# EAGLE design zerg_mc (EAGLE 7.6.0)
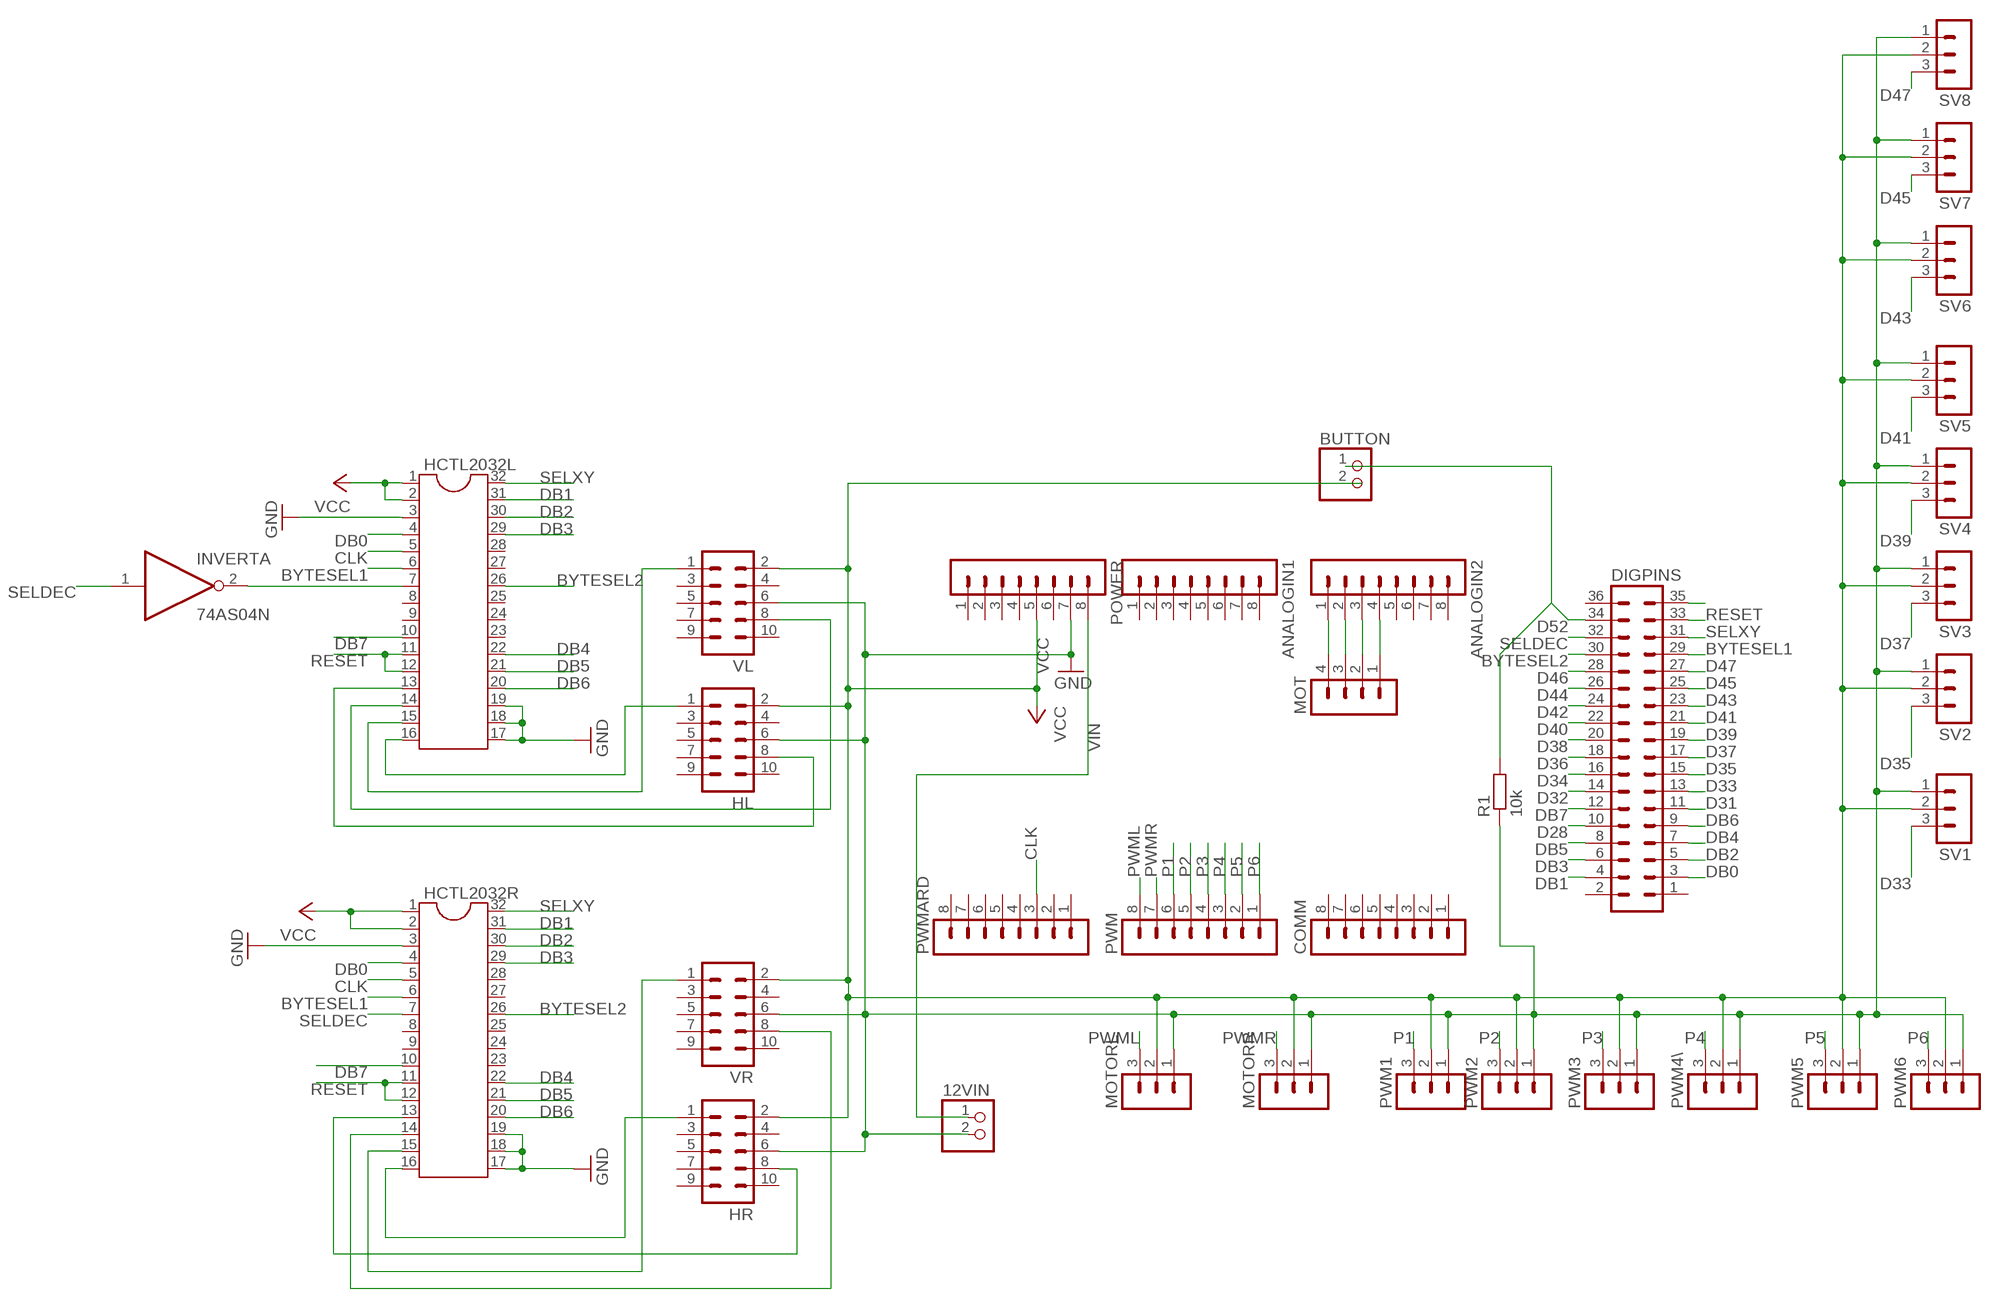
[diagram p0: schematic, sheet 1]

## Parts
12VIN  PINHD-1X2  [1X02]
ANALOGIN1  MA08-1  [MA08-1]
ANALOGIN2  MA08-1  [MA08-1]
BUTTON  PINHD-1X2  [1X02]
COMM  MA08-1  [MA08-1]
DIGPINS  MA18-2  [MA18-2]
HCTL2032L  DIL32  [DIL32]
HCTL2032R  DIL32  [DIL32]
HL  MA05-2  [MA05-2]
HR  MA05-2  [MA05-2]
INVERT  74AS04N  [DIL14]
MOT  MA04-1  [MA04-1]
MOTORL  MA03-1  [MA03-1]
MOTORR  MA03-1  [MA03-1]
POWER  MA08-1  [MA08-1]
PWM  MA08-1  [MA08-1]
PWM1  MA03-1  [MA03-1]
PWM2  MA03-1  [MA03-1]
PWM3  MA03-1  [MA03-1]
PWM4\  MA03-1  [MA03-1]
PWM5  MA03-1  [MA03-1]
PWM6  MA03-1  [MA03-1]
PWMARD  MA08-1  [MA08-1]
R1  10k  R-EU_0207/10  [0207/10]
SV1  MA03-1  [MA03-1]
SV2  MA03-1  [MA03-1]
SV3  MA03-1  [MA03-1]
SV4  MA03-1  [MA03-1]
SV5  MA03-1  [MA03-1]
SV6  MA03-1  [MA03-1]
SV7  MA03-1  [MA03-1]
SV8  MA03-1  [MA03-1]
VL  MA05-2  [MA05-2]
VR  MA05-2  [MA05-2]

## Nets
BYTESEL1: DIGPINS.29 HCTL2032L.6 HCTL2032R.6
BYTESEL2: DIGPINS.30 HCTL2032L.26 HCTL2032R.26
CLK: HCTL2032L.5 HCTL2032R.5 PWMARD.3
D28: DIGPINS.10
D31: DIGPINS.11
D32: DIGPINS.14
D33: DIGPINS.13 SV1.3
D34: DIGPINS.16
D35: DIGPINS.15 SV2.3
D36: DIGPINS.18
D37: DIGPINS.17 SV3.3
D38: DIGPINS.20
D39: DIGPINS.19 SV4.3
D40: DIGPINS.22
D41: DIGPINS.21 SV5.3
D42: DIGPINS.24
D43: DIGPINS.23 SV6.3
D44: DIGPINS.26
D45: DIGPINS.25 SV7.3
D46: DIGPINS.28
D47: DIGPINS.27 SV8.3
D52: BUTTON.1 DIGPINS.34 R1.2
DB0: DIGPINS.3 HCTL2032L.4 HCTL2032R.4
DB1: DIGPINS.4 HCTL2032L.31 HCTL2032R.31
DB2: DIGPINS.5 HCTL2032L.30 HCTL2032R.30
DB3: DIGPINS.6 HCTL2032L.29 HCTL2032R.29
DB4: DIGPINS.7 HCTL2032L.22 HCTL2032R.22
DB5: DIGPINS.8 HCTL2032L.21 HCTL2032R.21
DB6: DIGPINS.9 HCTL2032L.20 HCTL2032R.20
DB7: DIGPINS.12 HCTL2032L.10 HCTL2032R.10
GND: 12VIN.2 HCTL2032L.3 HCTL2032L.17 HCTL2032L.18 HCTL2032L.19 HCTL2032R.3 HCTL2032R.17 HCTL2032R.18 HCTL2032R.19 HL.6 HR.6 MOTORL.1 MOTORR.1 POWER.7 PWM1.1 PWM2.1 PWM3.1 PWM4\.1 PWM5.1 PWM6.1 R1.1 SV1.1 SV2.1 SV3.1 SV4.1 SV5.1 SV6.1 SV7.1 SV8.1 VL.6 VR.6
HLA: HCTL2032L.16 HL.1
HLB: HCTL2032L.13 HL.8
HRA: HCTL2032R.16 HR.1
HRB: HCTL2032R.13 HR.8
N$1: DIGPINS.35
N$4: ANALOGIN2.1 MOT.4
N$6: HCTL2032L.7 INVERT.2(A:O)
N$8: ANALOGIN2.2 MOT.3
N$9: ANALOGIN2.3 MOT.2
N$10: ANALOGIN2.4 MOT.1
P1: PWM1.3 PWM.6
P2: PWM2.3 PWM.5
P3: PWM3.3 PWM.4
P4: PWM4\.3 PWM.3
P5: PWM5.3 PWM.2
P6: PWM6.3 PWM.1
PWML: MOTORL.3 PWM.8
PWMR: MOTORR.3 PWM.7
RESET: DIGPINS.33 HCTL2032L.11 HCTL2032L.12 HCTL2032R.11 HCTL2032R.12
SELDEC: DIGPINS.32 HCTL2032R.7 INVERT.1(A:I)
SELXY: DIGPINS.31 HCTL2032L.32 HCTL2032R.32
VCC: HCTL2032L.1 HCTL2032L.2 HCTL2032R.1 HCTL2032R.2 HL.2 HR.2 MOTORL.2 MOTORR.2 POWER.5 PWM1.2 PWM2.2 PWM3.2 PWM4\.2 PWM5.2 PWM6.2 SV1.2 SV2.2 SV3.2 SV4.2 SV5.2 SV6.2 SV7.2 SV8.2 VL.2 VR.2
VIN: 12VIN.1 POWER.8
VLA: HCTL2032L.15 VL.1
VLB: HCTL2032L.14 VL.8
VRA: HCTL2032R.15 VR.1
VRB: HCTL2032R.14 VR.8
Unconnected: ANALOGIN1.1 ANALOGIN1.2 ANALOGIN1.3 ANALOGIN1.4 ANALOGIN1.5 ANALOGIN1.6 ANALOGIN1.7 ANALOGIN1.8 ANALOGIN2.5 ANALOGIN2.6 ANALOGIN2.7 ANALOGIN2.8 BUTTON.2 COMM.1 COMM.2 COMM.3 COMM.4 COMM.5 COMM.6 COMM.7 COMM.8 DIGPINS.1 DIGPINS.2 DIGPINS.36 HCTL2032L.8 HCTL2032L.9 HCTL2032L.23 HCTL2032L.24 HCTL2032L.25 HCTL2032L.27 HCTL2032L.28 HCTL2032R.8 HCTL2032R.9 HCTL2032R.23 HCTL2032R.24 HCTL2032R.25 HCTL2032R.27 HCTL2032R.28 HL.3 HL.4 HL.5 HL.7 HL.9 HL.10 HR.3 HR.4 HR.5 HR.7 HR.9 HR.10 INVERT.3(B:I) INVERT.4(B:O) INVERT.5(C:I) INVERT.6(C:O) INVERT.8(D:O) INVERT.9(D:I) INVERT.10(E:O) INVERT.11(E:I) INVERT.12(F:O) INVERT.13(F:I) POWER.1 POWER.2 POWER.3 POWER.4 POWER.6 PWMARD.1 PWMARD.2 PWMARD.4 PWMARD.5 PWMARD.6 PWMARD.7 PWMARD.8 VL.3 VL.4 VL.5 VL.7 VL.9 VL.10 VR.3 VR.4 VR.5 VR.7 VR.9 VR.10

## Power pins joined to a net without a drawn wire
GND: INVERT.7(P:GND)
VCC: INVERT.14(P:VCC)

## Library data of the parts
12VIN BUTTON = pinhead:PINHD-1X2: PIN HEADER
ANALOGIN1 ANALOGIN2 COMM POWER PWM PWMARD = con-lstb:MA08-1: PIN HEADER; OC_FARNELL: unknown; OC_NEWARK: unknown
DIGPINS = con-lstb:MA18-2: PIN HEADER; OC_FARNELL: unknown; OC_NEWARK: unknown
HCTL2032L HCTL2032R = ic-package:DIL32: Dual In Line
HL HR VL VR = con-lstb:MA05-2: PIN HEADER; OC_FARNELL: unknown; OC_NEWARK: unknown
INVERT = 74xx-eu:74*04: Hex INVERTER
MOT = con-lstb:MA04-1: PIN HEADER; OC_FARNELL: unknown; OC_NEWARK: unknown
MOTORL MOTORR PWM1-PWM3 PWM4\ PWM5 PWM6 SV1-SV8 = con-lstb:MA03-1: PIN HEADER; OC_FARNELL: unknown; OC_NEWARK: unknown
R1 = rcl:R-EU_: RESISTOR, European symbol

## Board
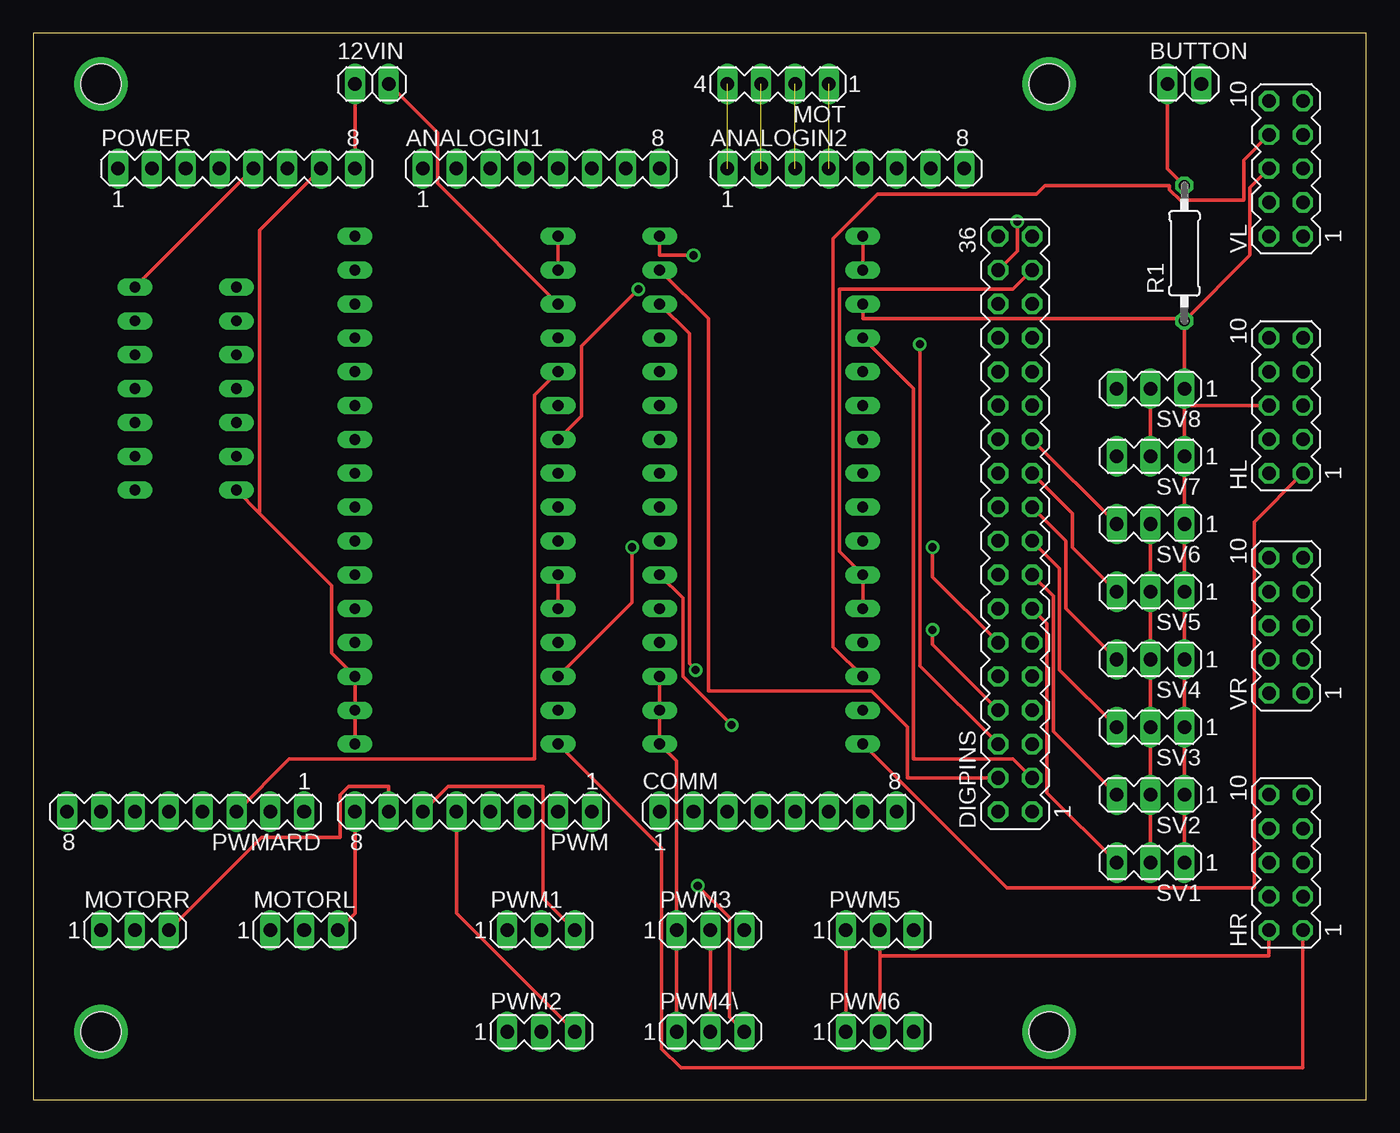
[diagram p1: board, top side]
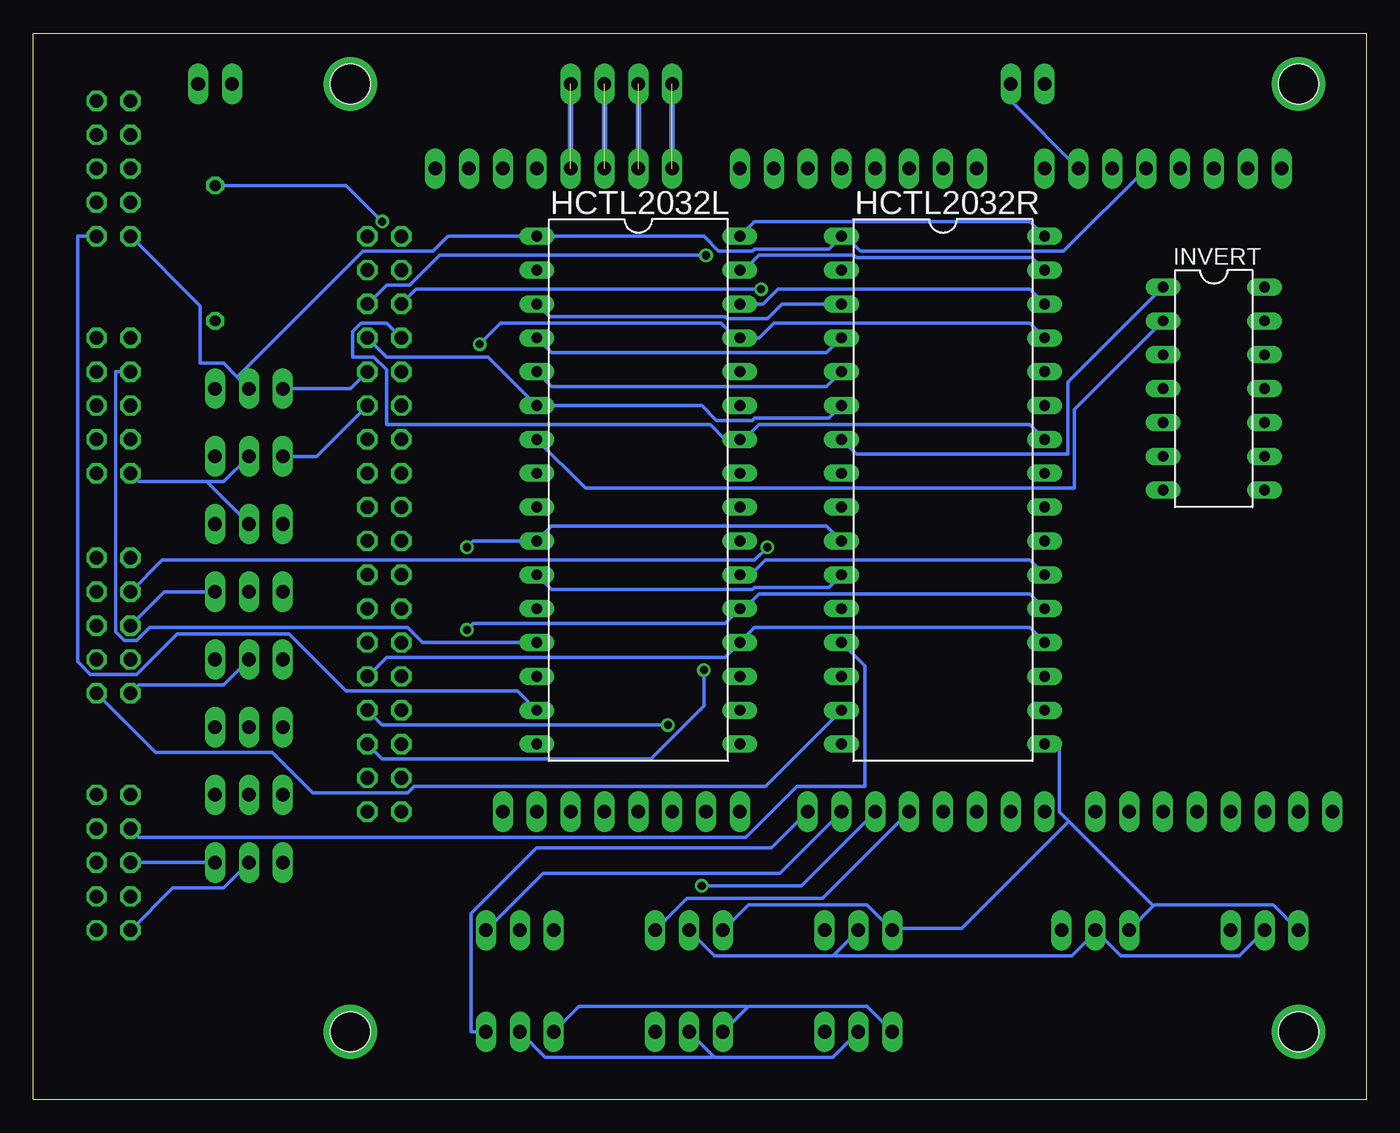
[diagram p2: board, bottom side, seen from below]

Size 100 x 80 mm. Coordinates in mm from the lower left corner, seen from the top.
Outline: 0,0 100,0 100,80 0,80 0,0
Copper layers (1*16): Top 0.035mm / dielectric 1.5mm / Bottom 0.035mm
Design rules "default": minimum track width 10mil, minimum drill 24mil, track to track 8mil, track to pad 8mil, pad to pad 8mil, via to via 8mil, smd to smd 8mil, copper to edge 40mil, drill to drill 8mil, minimum pad ring 10mil, minimum via ring 8mil, stop-mask expansion 4mil, vias tented up to drill 0mil, thermal gap 10mil
Holes 3 mm at 5.08,76.2 76.2,76.2 76.2,5.08 5.08,5.08
tRestrict: area 2.5,73.7 to 7.6,78.7; area 73.7,73.7 to 78.7,78.7; area 73.7,2.5 to 78.7,7.6; area 2.5,2.5 to 7.6,7.6
bRestrict: area 2.5,73.7 to 7.6,78.7; area 73.7,73.7 to 78.7,78.7; area 73.7,2.5 to 78.7,7.6; area 2.5,2.5 to 7.6,7.6

### Footprints (pad centres in the part's own frame; a part is rotated, then mirrored left to right if it is on the bottom)
1X02 = drill 1.016 long: 1 -1.27,0; 2 1.27,0
MA08-1 = drill 1.016 long: 1 -8.89,0; 2 -6.35,0; 3 -3.81,0; 4 -1.27,0; 5 1.27,0; 6 3.81,0; 7 6.35,0; 8 8.89,0
MA18-2 = drill 1.016 octagon: 1 -21.59,-1.27; 2 -21.59,1.27; 3 -19.05,-1.27; 4 -19.05,1.27; 5 -16.51,-1.27; 6 -16.51,1.27; 7 -13.97,-1.27; 8 -13.97,1.27; 9 -11.43,-1.27; 10 -11.43,1.27; 11 -8.89,-1.27; 12 -8.89,1.27; 13 -6.35,-1.27; 14 -6.35,1.27; 15 -3.81,-1.27; 16 -3.81,1.27; 17 -1.27,-1.27; 18 -1.27,1.27; 19 1.27,-1.27; 20 1.27,1.27; 21 3.81,-1.27; 22 3.81,1.27; 23 6.35,-1.27; 24 6.35,1.27; 25 8.89,-1.27; 26 8.89,1.27; 27 11.43,-1.27; 28 11.43,1.27; 29 13.97,-1.27; 30 13.97,1.27; 31 16.51,-1.27; 32 16.51,1.27; 33 19.05,-1.27; 34 19.05,1.27; 35 21.59,-1.27; 36 21.59,1.27
DIL32 = drill 0.813 long: 1 -19.05,-7.62; 2 -16.51,-7.62; 3 -13.97,-7.62; 4 -11.43,-7.62; 5 -8.89,-7.62; 6 -6.35,-7.62; 7 -3.81,-7.62; 8 -1.27,-7.62; 9 1.27,-7.62; 10 3.81,-7.62; 11 6.35,-7.62; 12 8.89,-7.62; 13 11.43,-7.62; 14 13.97,-7.62; 15 16.51,-7.62; 16 19.05,-7.62; 17 19.05,7.62; 18 16.51,7.62; 19 13.97,7.62; 20 11.43,7.62; 21 8.89,7.62; 22 6.35,7.62; 23 3.81,7.62; 24 1.27,7.62; 25 -1.27,7.62; 26 -3.81,7.62; 27 -6.35,7.62; 28 -8.89,7.62; 29 -11.43,7.62; 30 -13.97,7.62; 31 -16.51,7.62; 32 -19.05,7.62
MA05-2 = drill 1.016 octagon: 1 -5.08,-1.27; 2 -5.08,1.27; 3 -2.54,-1.27; 4 -2.54,1.27; 5 0,-1.27; 6 0,1.27; 7 2.54,-1.27; 8 2.54,1.27; 9 5.08,-1.27; 10 5.08,1.27
DIL14 = drill 0.813 long: 1 -7.62,-3.81; 2 -5.08,-3.81; 3 -2.54,-3.81; 4 0,-3.81; 5 2.54,-3.81; 6 5.08,-3.81; 7 7.62,-3.81; 8 7.62,3.81; 9 5.08,3.81; 10 2.54,3.81; 11 0,3.81; 12 -2.54,3.81; 13 -5.08,3.81; 14 -7.62,3.81
MA04-1 = drill 1.016 long: 1 -3.81,0; 2 -1.27,0; 3 1.27,0; 4 3.81,0
MA03-1 = drill 1.016 long: 1 -2.54,0; 2 0,0; 3 2.54,0
0207/10 = drill 0.813 octagon: 1 -5.08,0; 2 5.08,0

### Placement (x,y rotation side)
12VIN  25.4,76.2 0 top
ANALOGIN1  38.1,69.85 0 top
ANALOGIN2  60.96,69.85 0 top
BUTTON  86.36,76.2 0 top
COMM  55.88,21.59 0 top
DIGPINS  73.66,43.18 90 top
HCTL2032L  54.61,45.72 270 bottom
HCTL2032R  31.75,45.72 270 bottom
HL  93.98,52.07 90 top
HR  93.98,17.78 90 top
INVERT  11.43,53.34 270 bottom
MOT  55.88,76.2 180 top
MOTORL  20.32,12.7 0 top
MOTORR  7.62,12.7 0 top
POWER  15.24,69.85 0 top
PWM  33.02,21.59 180 top
PWM1  38.1,12.7 0 top
PWM2  38.1,5.08 0 top
PWM3  50.8,12.7 0 top
PWM4\  50.8,5.08 0 top
PWM5  63.5,12.7 0 top
PWM6  63.5,5.08 0 top
PWMARD  11.43,21.59 180 top
R1  86.36,63.5 90 top
SV1  83.82,17.78 180 top
SV2  83.82,22.86 180 top
SV3  83.82,27.94 180 top
SV4  83.82,33.02 180 top
SV5  83.82,38.1 180 top
SV6  83.82,43.18 180 top
SV7  83.82,48.26 180 top
SV8  83.82,53.34 180 top
VL  93.98,69.85 90 top
VR  93.98,35.56 90 top

### Tracks (layer width: path | path; a pad name or v marks a point on that pad's centre or on a via)
BYTESEL1
  Bottom 0.254: HCTL2032R.6 40.32,51.12 45.88,51.12 46.04,50.96 48.74,50.96 49.85,52.07 HCTL2032L.6 65.88,55.72 73.5,55.72 DIGPINS.29
BYTESEL2
  Bottom 0.254: HCTL2032R.26 25.24,50.64 45.56,50.64 46.67,49.53 HCTL2032L.26 48.1,49.53 49.21,50.64 73.5,50.64 73.5,54.77 74.45,55.72 76.04,55.72 76.04,57.63 75.41,58.26 73.5,58.26 DIGPINS.30
CLK
  Top 0.254: PWMARD.3 19.21,25.56 37.62,25.56 37.62,52.86 HCTL2032R.5
  Bottom 0.254: HCTL2032R.5 40.48,53.5 61.12,53.5 HCTL2032L.5
D33
  Top 0.254: SV1.3 76.04,23.02 76.04,35.72 DIGPINS.13
D35
  Top 0.254: SV2.3 76.52,27.62 76.52,37.78 DIGPINS.15
D37
  Top 0.254: SV3.3 76.99,32.23 76.99,39.85 DIGPINS.17
D39
  Top 0.254: SV4.3 77.47,36.83 77.47,41.91 DIGPINS.19
D41
  Top 0.254: SV5.3 77.95,41.43 77.95,43.97 DIGPINS.21
D43
  Top 0.254: SV6.3 DIGPINS.23
D45
  Bottom 0.254: DIGPINS.25 78.74,48.26 SV7.3
D47
  Bottom 0.254: DIGPINS.27 76.2,53.34 SV8.3
D52  (via drill 0.61)
  Top 0.254: R1.2 85.09,69.85 BUTTON.1 | DIGPINS.34 73.82,63.66 v73.82,65.88
  Bottom 0.254: v73.82,65.88 76.52,68.58 R1.2
DB0
  Top 0.254: DIGPINS.3 73.5,25.56 66.04,25.56 66.04,53.34 HCTL2032L.4
  Bottom 0.254: HCTL2032R.4 40.48,56.04 61.12,56.04 HCTL2032L.4
DB1
  Top 0.254: DIGPINS.4 65.56,24.13 65.56,27.94 62.87,30.64 50.64,30.64 50.64,58.58 HCTL2032L.31
  Bottom 0.254: HCTL2032R.31 25.08,63.18 38.26,63.18 38.42,63.34 45.56,63.34 46.67,62.23 HCTL2032L.31
DB2  (via drill 0.61)
  Top 0.254: v49.69,32.23 49.21,32.7 49.21,57.47 HCTL2032L.30
  Bottom 0.254: HCTL2032R.30 25.24,60.8 44.13,60.8 45.24,59.69 HCTL2032L.30 | DIGPINS.5 73.82,25.56 53.66,25.56 49.69,29.53 v49.69,32.23
DB3  (via drill 0.61)
  Top 0.254: DIGPINS.6 66.52,32.54 v66.52,56.67
  Bottom 0.254: HCTL2032R.29 25.24,58.26 44.45,58.26 45.56,57.15 HCTL2032L.29 47.31,57.15 48.42,58.26 64.93,58.26 v66.52,56.67
DB4  (via drill 0.61)
  Top 0.254: v52.39,28.1 48.74,31.75 48.74,37.62 HCTL2032L.22
  Bottom 0.254: HCTL2032R.22 25.24,40.48 45.09,40.48 46.2,39.37 HCTL2032L.22 | DIGPINS.7 73.82,28.1 v52.39,28.1
DB5  (via drill 0.61)
  Top 0.254: DIGPINS.8 67.47,34.13 v67.47,35.24
  Bottom 0.254: HCTL2032R.21 25.24,37.94 45.56,37.94 46.67,36.83 HCTL2032L.21 48.1,35.72 66.99,35.72 v67.47,35.24
DB6
  Bottom 0.254: HCTL2032R.20 25.24,35.4 45.88,35.4 HCTL2032L.20 48.1,33.18 73.5,33.18 DIGPINS.9
DB7  (via drill 0.61)
  Top 0.254: DIGPINS.12 67.47,39.21 v67.47,41.43
  Bottom 0.254: HCTL2032R.10 40.48,43.02 61.12,43.02 HCTL2032L.10 66.99,41.91 v67.47,41.43
GND
  Top 0.254: R1.1 SV8.1 86.36,52.07 | 86.36,52.07 SV7.1 SV6.1 SV5.1 SV4.1 SV3.1 SV2.1 SV1.1 | 86.36,52.07 HL.6 | VL.6 91.28,68.42 91.28,63.34 R1.1 | HCTL2032R.3 30.32,68.74 30.32,72.55 12VIN.2 | HCTL2032R.17 HCTL2032R.18 HCTL2032R.19 22.38,33.5 22.38,38.58 16.91,44.05 | 16.91,44.05 INVERT.7 | HCTL2032L.19 HCTL2032L.18 HCTL2032L.17 48.26,25.4 PWM3.1 PWM4\.1 | PWM5.1 PWM6.1 | POWER.7 16.99,65.25 16.99,44.13 16.91,44.05 | HCTL2032L.3 62.23,58.58 86.36,58.58 R1.1
  Bottom 0.254: VR.6 90.17,38.1 SV5.1 | SV1.1 HR.6 | HCTL2032L.3 61.28,58.74 48.1,58.74 47.94,58.58 44.93,58.58 43.81,59.69 HCTL2032R.3 | POWER.7 26.67,74.93 12VIN.2 | MOTORR.1 6.99,14.61 15.88,14.61 15.95,14.53 | MOTORL.1 15.95,14.53 | 22.3,20.88 23.02,21.59 23.02,26.67 HCTL2032R.17 | 22.3,20.88 15.95,14.53 | PWM3.1 46.35,14.61 37.47,14.61 PWM1.1 35.56,12.86 30.32,12.86 22.3,20.88 | PWM2.1 37.47,6.99 46.35,6.99 46.43,6.91 | PWM4\.1 46.43,6.91 | PWM6.1 59.05,6.99 46.51,6.99 46.43,6.91
HLA
  Top 0.254: HCTL2032L.16 73.03,15.88 91.6,15.88 91.6,43.34 HL.1
HLB
  Bottom 0.254: HCTL2032L.13 70.8,34.29 71.91,35.4 91.28,35.4 92.23,34.45 93.19,34.45 93.82,35.08 93.82,54.61 HL.8
HRA
  Top 0.254: HCTL2032R.16 47.15,18.89 47.15,3.81 48.58,2.38 95.25,2.38 HR.1
HRB
  Bottom 0.254: HCTL2032R.13 37.62,32.54 37.62,23.5 42.7,23.5 46.51,19.68 92.08,19.68 HR.8
N$2  (via drill 3)
  other vias: 5.08,5.08
N$3  (via drill 3)
  other vias: 5.08,76.2
N$4  (1 unrouted)
  Bottom 0.406: MOT.4 ANALOGIN2.1
N$5  (via drill 3)
  other vias: 76.2,76.2
N$6
  Bottom 0.254: INVERT.2 21.91,51.75 21.91,45.88 58.58,45.88 HCTL2032L.7
N$7  (via drill 3)
  other vias: 76.2,5.08
N$8  (1 unrouted)
  Bottom 0.406: MOT.3 ANALOGIN2.2
N$9  (1 unrouted)
  Bottom 0.406: MOT.2 ANALOGIN2.3
N$10  (1 unrouted)
  Bottom 0.406: MOT.1 ANALOGIN2.4
P1
  Top 0.254: PWM.6 31.11,23.5 38.26,23.5 38.26,15.08 PWM1.3
P2
  Top 0.254: PWM2.3 31.75,13.97 PWM.5
P3
  Bottom 0.254: PWM.4 40.8,15.08 50.96,15.08 PWM3.3
P4  (via drill 0.61)
  Top 0.254: v49.85,16.03 52.23,13.65 52.23,6.19 PWM4\.3
  Bottom 0.254: PWM.3 42.39,16.03 v49.85,16.03
P5
  Bottom 0.254: PWM.2 43.97,16.99 61.75,16.99 PWM5.3
P6
  Bottom 0.254: PWM.1 44.61,18.89 62.23,18.89 67.15,13.97 67.15,5.08 PWM6.3
PWML
  Top 0.254: MOTORL.3 24.13,13.97 PWM.8
PWMR
  Top 0.254: MOTORR.3 17.14,19.68 23.02,19.68 23.02,22.86 23.65,23.5 26.67,23.5 PWM.7
RESET
  Top 0.254: HCTL2032R.11 HCTL2032R.12 | HCTL2032L.12 HCTL2032L.11 60.48,41.12 60.48,60.8 73.5,60.8 DIGPINS.33
  Bottom 0.254: HCTL2032R.11 40.32,38.42 45.88,38.42 46.04,38.26 61.12,38.26 HCTL2032L.11
SELDEC  (via drill 0.61)
  Top 0.254: v45.4,60.8 41.12,56.52 41.12,51.28 HCTL2032R.7
  Bottom 0.254: INVERT.1 22.38,53.82 22.38,48.42 38.26,48.42 HCTL2032R.7 | DIGPINS.32 71.28,60.8 v45.4,60.8
SELXY  (via drill 0.61)
  Top 0.254: v49.53,63.34 46.99,63.34 HCTL2032L.32
  Bottom 0.254: HCTL2032R.32 25.24,65.88 45.88,65.88 HCTL2032L.32 | DIGPINS.31 73.5,61.12 71.75,61.12 69.53,63.34 v49.53,63.34
VCC
  Top 0.254: PWM5.2 63.5,10.79 | 63.5,10.79 PWM6.2 | PWM3.2 PWM4\.2 | SV1.2 SV2.2 SV3.2 SV4.2 SV5.2 SV6.2 | SV8.2 SV7.2 | POWER.5 INVERT.14 | HCTL2032R.1 HCTL2032R.2 | HCTL2032L.1 HCTL2032L.2 | 63.5,10.79 92.71,10.79 HR.2
  Bottom 0.254: PWM2.2 40.01,3.17 48.9,3.17 48.97,3.25 | PWM4\.2 48.97,3.25 | PWM6.2 61.59,3.17 49.05,3.17 48.97,3.25 | MOTORR.2 9.53,10.79 18.41,10.79 MOTORL.2 20.32,12.54 22.07,10.79 39.85,10.79 39.93,10.87 | 39.93,10.87 40.01,10.79 48.9,10.79 PWM3.2 | 39.93,10.87 PWM1.2 | VR.2 92.08,31.11 85.72,31.11 SV4.2 | HR.2 89.53,15.88 85.72,15.88 SV1.2 | HL.2 92.08,46.35 87,46.35 | 87,46.35 85.72,46.35 SV7.2 | VL.2 87.47,59.53 87.47,55.24 85.72,55.24 84.69,54.21 | SV8.2 84.69,54.21 | 87,46.35 SV6.2 | POWER.5 22.7,63.66 37.94,63.66 38.89,64.61 39.37,64.61 HCTL2032R.1 40.32,63.82 45.88,63.82 46.04,63.66 48.58,63.66 49.69,64.77 HCTL2032L.1 68.9,64.77 70.01,63.66 75.25,63.66 84.69,54.21
VIN
  Top 0.254: 12VIN.1 POWER.8
VLA
  Bottom 0.254: HCTL2032L.15 63.66,30.64 76.52,30.64 80.8,34.92 89.22,34.92 92.23,31.91 95.73,31.91 96.68,32.86 96.68,64.77 VL.1
VLB
  Top 0.254: HCTL2032L.14 60.01,33.97 60.01,64.61 63.34,67.94 75.25,67.94 75.88,68.58 85.25,68.58 85.25,68.26 86.04,67.47 90.81,67.47 90.81,70.48 VL.8
VRA
  Bottom 0.254: HCTL2032R.15 45.09,23.5 71.44,23.5 71.91,23.02 79.06,23.02 82.07,26.04 90.81,26.04 VR.1
VRB  (via drill 0.61)
  Top 0.254: HCTL2032R.14 44.93,37.31 v44.93,41.43
  Bottom 0.254: v44.93,41.43 45.88,40.48 90.33,40.48 VR.8